# EAGLE design mitutoyo_interface (EAGLE 7.5.0)
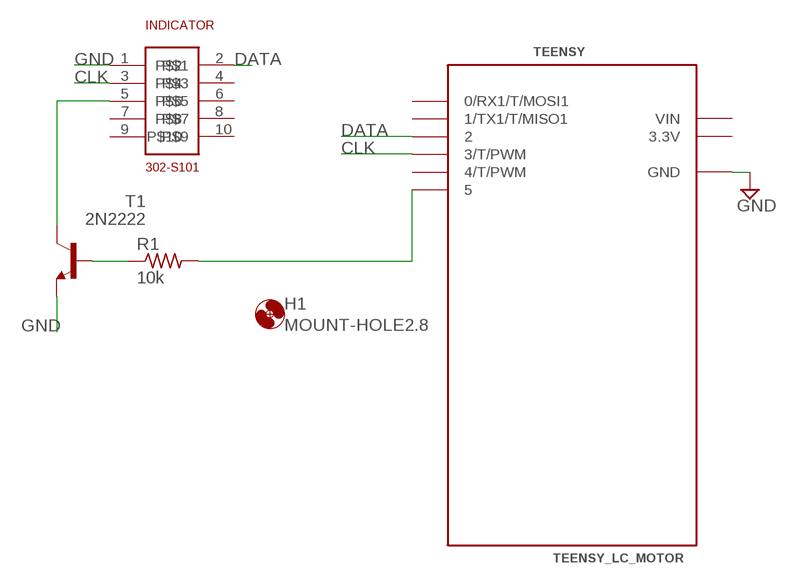
[diagram p0: schematic, sheet 1]

## Parts
H1  MOUNT-HOLE2.8  [2,8]
INDICATOR  302-S101  [302-S101]
R1  10k  R-US_R0805  [R0805]
T1  2N2222  [TO92-EBC-OVAL]
TEENSY  TEENSY_LC_MOTOR  [TEENSYLC-MOTOR]

## Nets
CLK: INDICATOR.3 TEENSY.3(3/T/PWM)
DATA: INDICATOR.2 TEENSY.2
GND: INDICATOR.1 T1.E TEENSY.GND
N$1: INDICATOR.5 T1.C
N$2: R1.1 T1.B
N$3: R1.2 TEENSY.5
Unconnected: INDICATOR.4 INDICATOR.6 INDICATOR.7 INDICATOR.8 INDICATOR.9 INDICATOR.10 TEENSY.0(0/RX1/T/MOSI1) TEENSY.1(1/TX1/T/MISO1) TEENSY.4(4/T/PWM)

## Power pins joined to a net without a drawn wire
3.3V: TEENSY.3.3V
VIN: TEENSY.VIN

## Library data of the parts
H1 = holes:MOUNT-HOLE: MOUNTING HOLE with drill center marker
INDICATOR = connectors:302-S101: 302-S101 10 pin connector 2.5 mm pitch
R1 = resistor:R-US_: RESISTOR, American symbol
T1 = adafruit:2N2222: NPN TRANSISTOR Big oval pads
TEENSY = Teensy_3_and_LC_Series_Boards_v1.1:TEENSY_LC_MOTOR: teensy, motors only

## Board
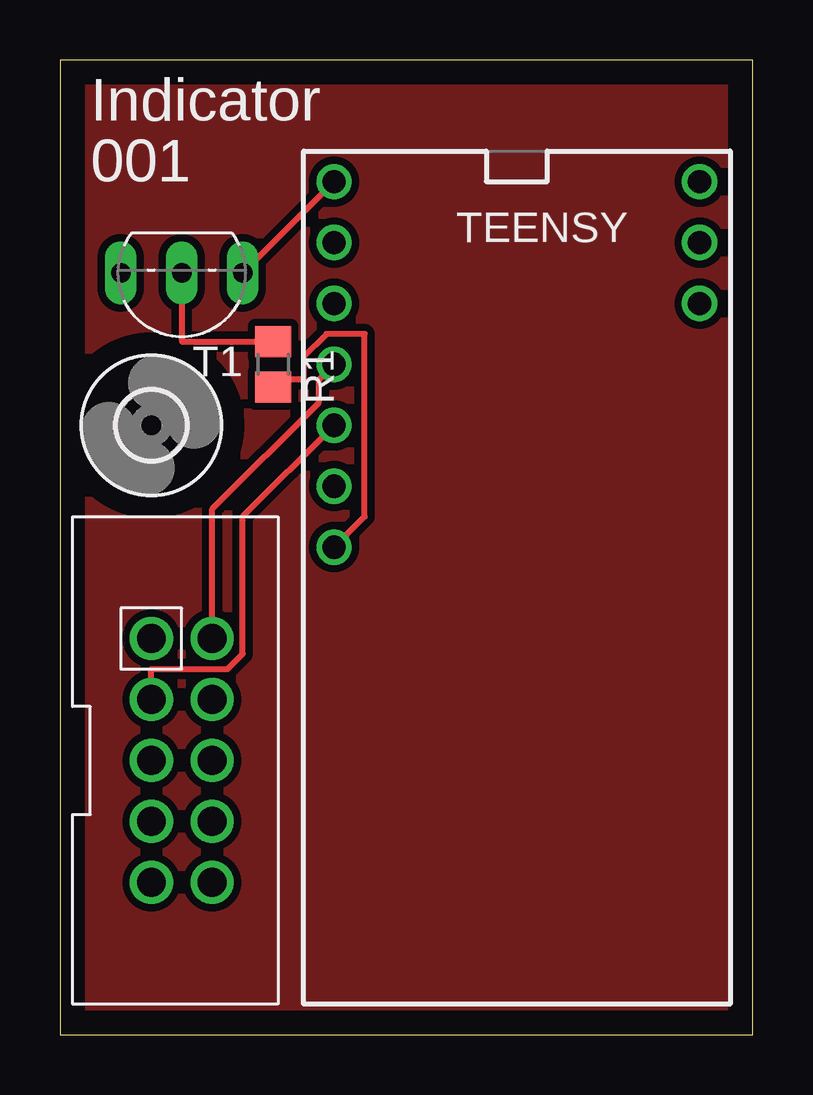
[diagram p1: board, top side]
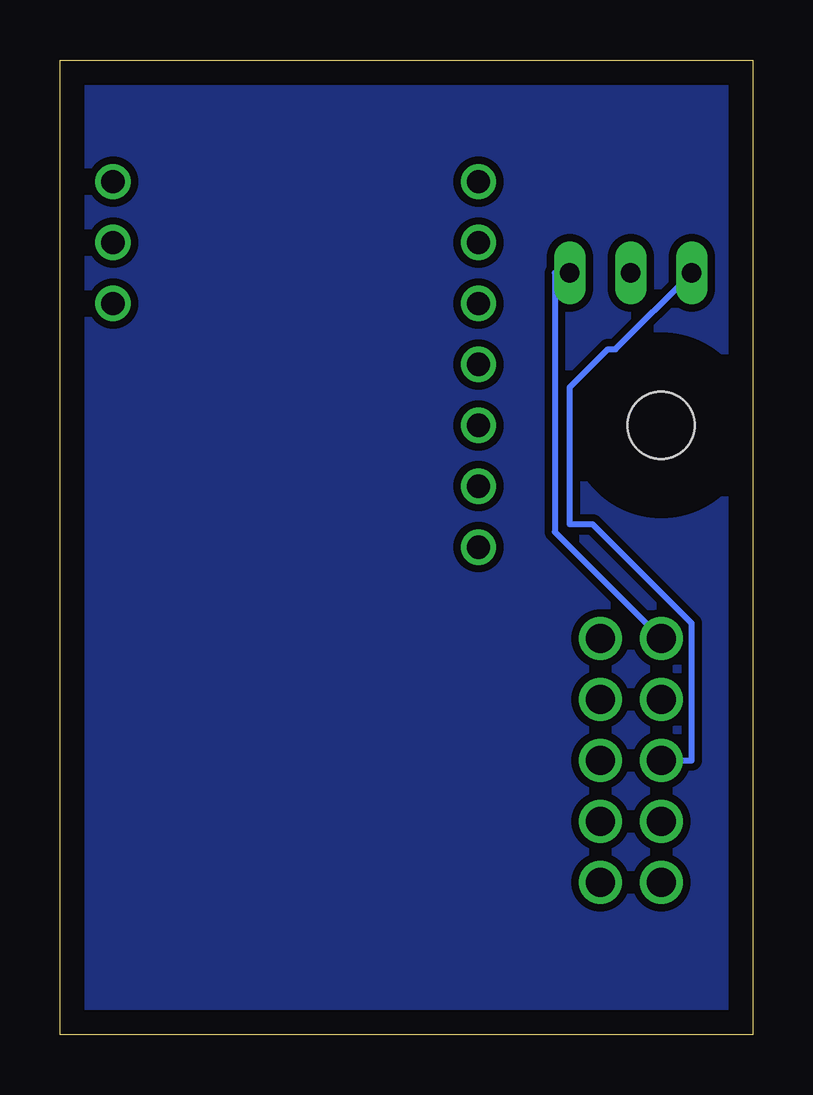
[diagram p2: board, bottom side, seen from below]

Size 28.88 x 40.63 mm. Coordinates in mm from the lower left corner, seen from the top.
Outline: 0,0 28.88,0 28.88,40.63 0,40.63 0,0
Copper layers (1*16): Top 0.035mm / dielectric 1.5mm / Bottom 0.035mm
Design rules "default": minimum track width 10mil, minimum drill 24mil, track to track 8mil, track to pad 8mil, pad to pad 8mil, via to via 8mil, smd to smd 8mil, copper to edge 40mil, drill to drill 8mil, minimum pad ring 10mil, minimum via ring 8mil, stop-mask expansion 4mil, vias tented up to drill 0mil, thermal gap 10mil

### Footprints (pad centres in the part's own frame; a part is rotated, then mirrored left to right if it is on the bottom)
2,8 = hole 2.8: 0,0
302-S101 = drill 1.2: 1 0,0; 2 2.54,0; 3 0,-2.54; 4 2.54,-2.54; 5 0,-5.08; 6 2.54,-5.08; 7 0,-7.62; 8 2.54,-7.62; 9 0,-10.16; 10 2.54,-10.16
R0805 = smd 1.3 x 1.5: 1 -0.95,0; 2 0.95,0
TO92-EBC-OVAL = drill 0.813 long: B 0,-1.27; C 2.54,-1.27; E -2.54,-1.27
TEENSYLC-MOTOR = drill 0.965: 0 -7.62,13.97; 1 -7.62,11.43; 2 -7.62,8.89; 3 -7.62,6.35; 3.3V 7.62,11.43; 4 -7.62,3.81; 5 -7.62,1.27; AGND 7.62,13.97; GND -7.62,16.51; VIN 7.62,16.51

### Placement (x,y rotation side)
H1  3.81,25.4 0 top
INDICATOR  3.81,16.51 0 top
R1  8.89,27.94 270 top
T1  5.08,30.48 180 top
TEENSY  19.05,19.05 0 top

### Tracks (layer width: path | path; a pad name or v marks a point on that pad's centre or on a via)
CLK
  Top 0.254: TEENSY.3 7.62,21.59 7.62,15.88 6.99,15.24 3.81,15.24 INDICATOR.3
DATA
  Top 0.254: TEENSY.2 10.79,27.3 10.79,26.35 6.35,21.91 INDICATOR.2
GND
  Top 0.254: TEENSY.GND T1.E
  Bottom 0.254: INDICATOR.1 8.26,20.95 8.26,31.75 T1.E
N$1
  Bottom 0.254: T1.C 5.71,28.57 6.03,28.57 7.62,26.99 7.62,21.27 6.67,21.27 2.54,17.14 2.54,11.43 INDICATOR.5
N$2
  Top 0.254: T1.B 5.08,28.89 R1.1
N$3
  Top 0.254: TEENSY.5 12.7,21.59 12.7,29.21 11.11,29.21 10.16,28.26 10.16,27.3 8.89,27.3 R1.2
N$4
  pour Top (isolate 0.305): 0,40.64 29.21,40.64 29.21,0 0,0
N$5
  pour Bottom (isolate 0.305): 0,0 0,40.64 27.94,40.64 27.94,0